# Altium project ISL6236A Board.PrjPcb
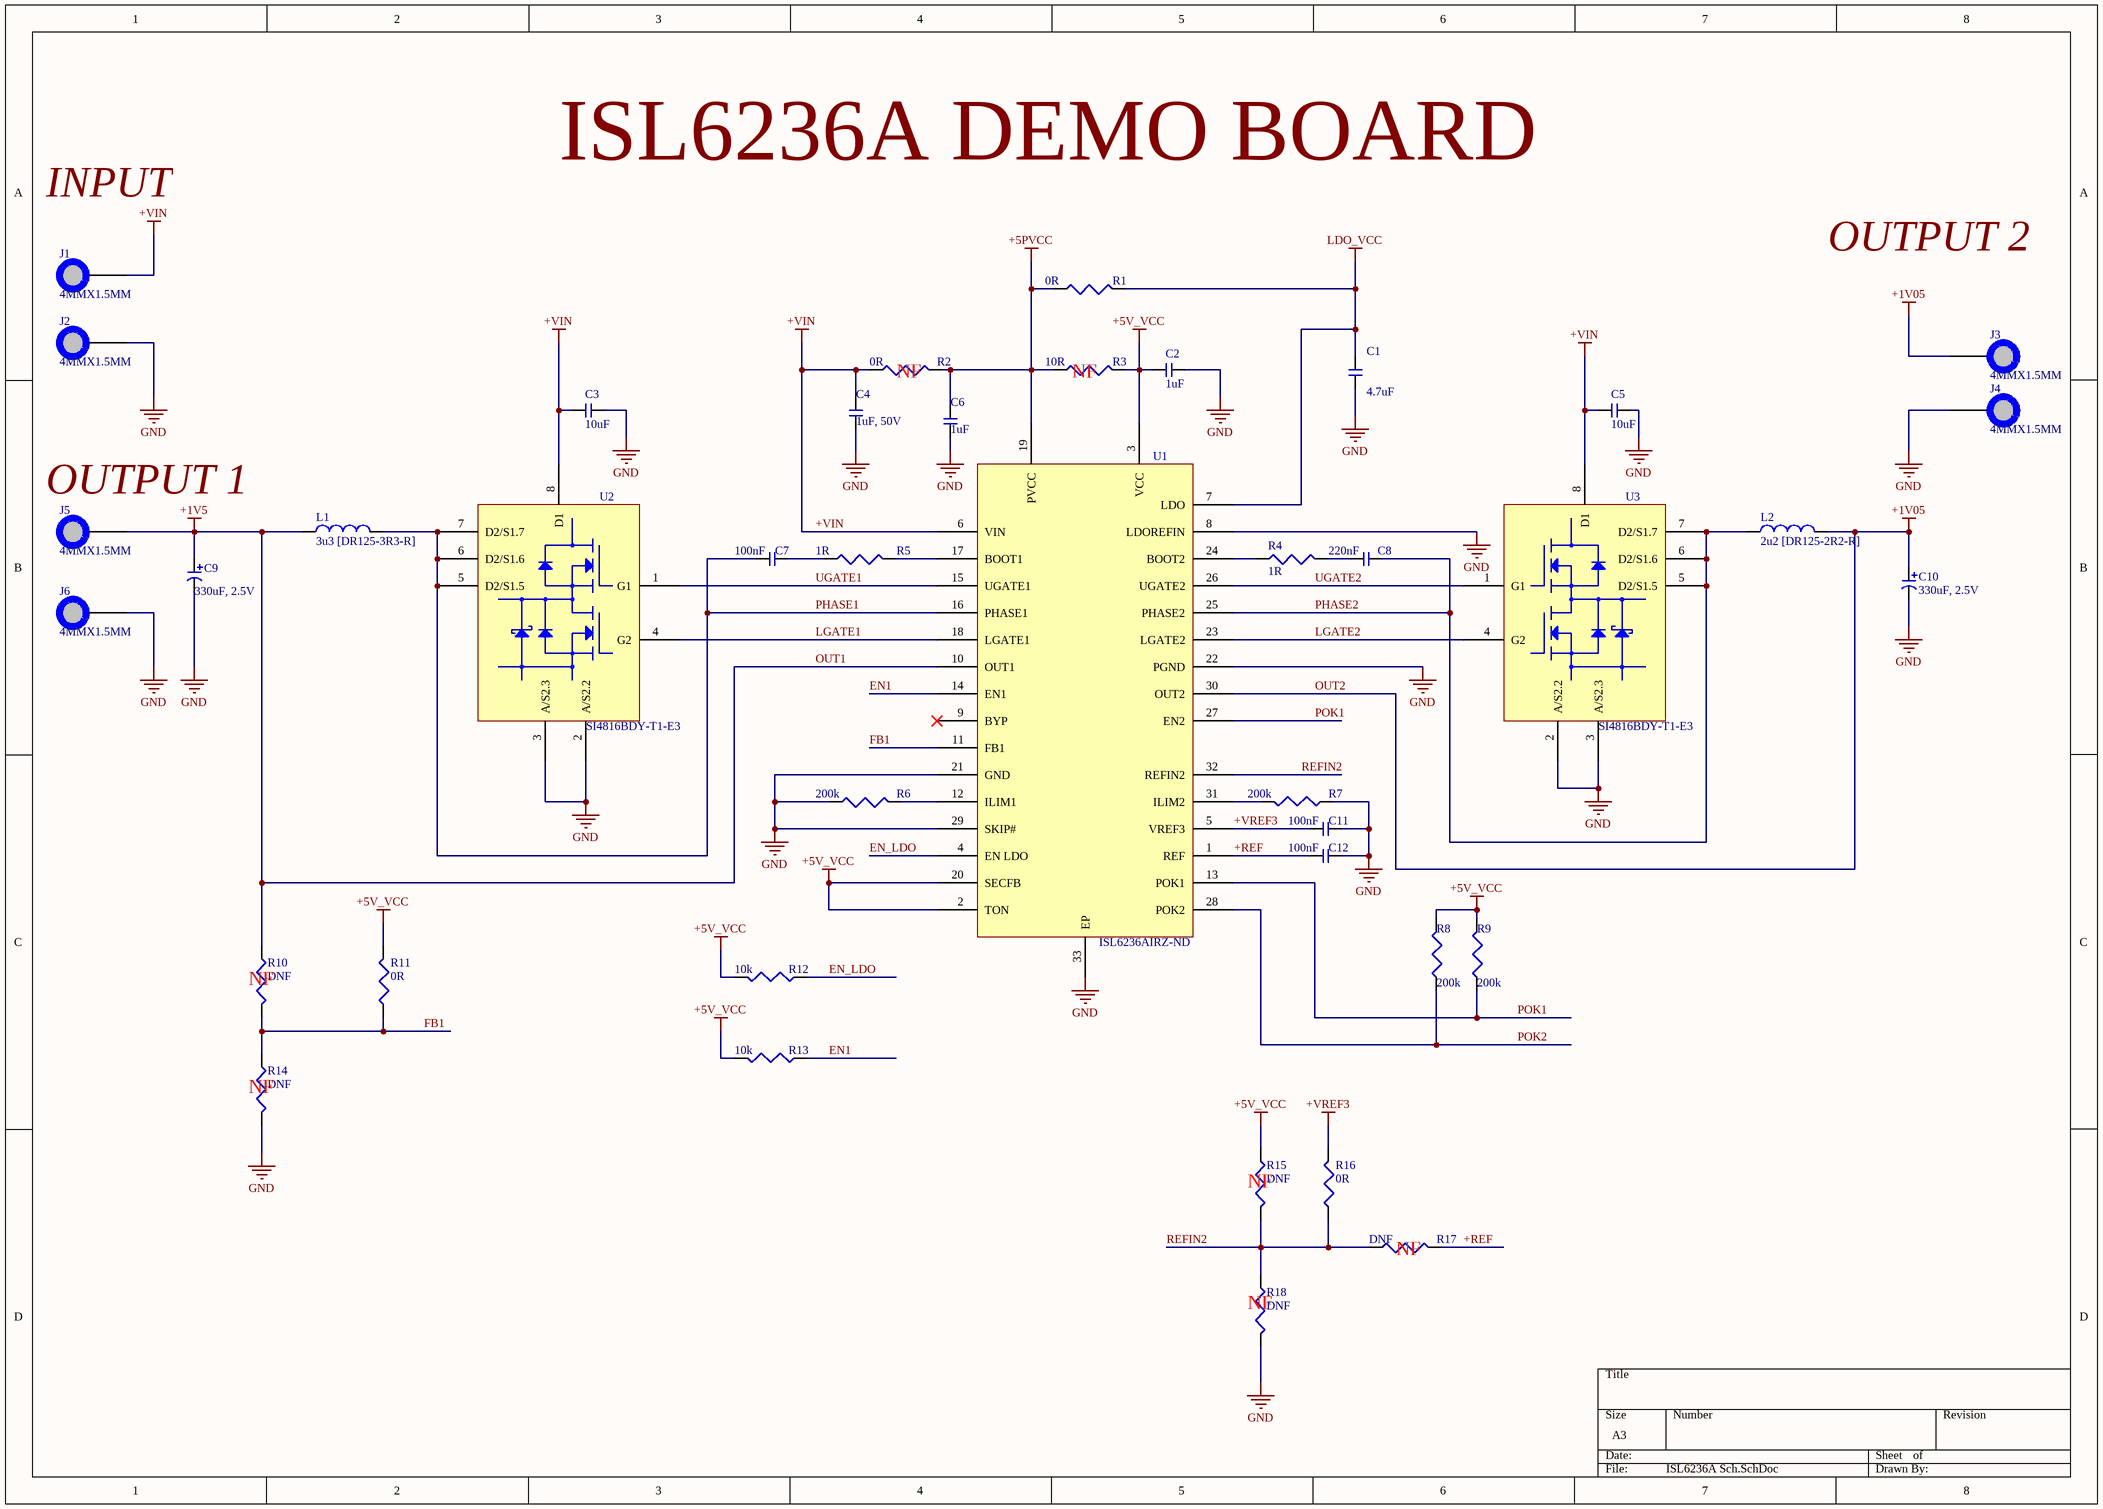
[diagram p0: ISL6236A Sch.SchDoc]
1 sheet, 41 parts. Net scope: global (net labels, ports and power ports of the same name join across sheets).
Board file: ISL6236A PCB.PcbDoc

## Sheet ISL6236A Sch.SchDoc
size A3

### Parts
C1  4.7uF  [C0805]
C2  1uF  [C0805]
C3  10uF  [C1210]
C4  1uF, 50V  [C0805]
C5  10uF  [C1210]
C6  1uF  [C0805]
C7  100nF  [C0805]
C8  220nF  [C1206]
C9  330uF, 2.5V  [CPOL1210TCJ]
C10  330uF, 2.5V  [CPOL1210TCJ]
C11  100nF  [C0805]
C12  100nF  [C0805]
J1  4MMX1.5MM  [PAD_WITH_HOLE_4MMX1.5MM]
J2  4MMX1.5MM  [PAD_WITH_HOLE_4MMX1.5MM]
J3  4MMX1.5MM  [PAD_WITH_HOLE_4MMX1.5MM]
J4  4MMX1.5MM  [PAD_WITH_HOLE_4MMX1.5MM]
J5  4MMX1.5MM  [PAD_WITH_HOLE_4MMX1.5MM]
J6  4MMX1.5MM  [PAD_WITH_HOLE_4MMX1.5MM]
L1  3u3 [DR125-3R3-R]  [DR125]
L2  2u2 [DR125-2R2-R]  [DR125]
R1  0R  [R0603]
R2  0R  [R0603]
R3  10R  [R0805]
R4  1R  [R0805]
R5  1R  [R0805]
R6  200k  [R0805]
R7  200k  [R0805]
R8  200k  [R0805]
R9  200k  [R0805]
R10  DNF  [R0805]
R11  0R  [R0603]
R12  10k  [R0805]
R13  10k  [R0805]
R14  DNF  [R0805]
R15  DNF  [R0805]
R16  0R  [R0603]
R17  DNF  [R0805]
R18  DNF  [R0805]
U1  ISL6236AIRZ-ND  [L32.5x5B]
U2  SI4816BDY-T1-E3  [SO-8]
U3  SI4816BDY-T1-E3  [SO-8]

### Nets
+5PVCC: C6.2 R1.1 R2.2 R3.1 U1.19(PVCC)
+5V_VCC: C2.1 R3.2 R8.2 R9.2 R11.2 R12.2 R13.2 R15.1 U1.2(TON) U1.3(VCC) U1.20(SECFB)
+VIN: C3.2 C4.1 C5.1 J1.1 R2.1 U1.6(VIN) U2.8(D1) U3.8(D1)
+VREF3: C11.1 R16.2 U1.5(VREF3)
GND: C1.2 C2.2 C3.1 C4.2 C5.2 C6.1 C9.2 C10.2 C11.2 C12.2 J2.1 J4.1 J6.1 R6.1 R7.1 R14.2 R18.2 U1.8(LDOREFIN) U1.21(GND) U1.22(PGND) U1.29(SKIP#) U1.33(EP) U2.2(A/S2.2) U2.3(A/S2.3) U3.2(A/S2.2) U3.3(A/S2.3)
LDO_VCC: C1.1 R1.2 U1.7(LDO)
OUT1: C9.1 J5.1 L1.1 R10.1 U1.10(OUT1)  [also labelled +1V5]
OUT2: C10.1 J3.1 L2.2 U1.30(OUT2)  [also labelled +1V05]
+REF: C12.1 R17.2 U1.1(REF)
EN1: R13.1 U1.14(EN1)
EN_LDO: R12.1 U1.4(EN_LDO)
FB1: R10.2 R11.1 R14.1 U1.11(FB1)
LGATE1: U1.18(LGATE1) U2.4(G2)
LGATE2: U1.23(LGATE2) U3.4(G2)
PHASE1: C7.2 L1.2 U1.16(PHASE1) U2.5(D2/S1.5) U2.6(D2/S1.6) U2.7(D2/S1.7)
PHASE2: C8.2 L2.1 U1.25(PHASE2) U3.5(D2/S1.5) U3.6(D2/S1.6) U3.7(D2/S1.7)
POK1: R9.1 U1.13(POK1) U1.27(EN2)
POK2: R8.1 U1.28(POK2)
REFIN2: R15.2 R16.1 R17.1 R18.1 U1.32(REFIN2)
UGATE1: U1.15(UGATE1) U2.1(G1)
UGATE2: U1.26(UGATE2) U3.1(G1)
NetC7_1: C7.1 R5.1
NetC8_1: C8.1 R4.2
NetR4_1: R4.1 U1.24(BOOT2)
NetR5_2: R5.2 U1.17(BOOT1)
NetR6_2: R6.2 U1.12(ILIM1)
NetR7_2: R7.2 U1.31(ILIM2)

Not connected (* = marked no-connect by the designer): U1 9(BYP)*

### Notes on the sheet
- ISL6236A DEMO BOARD
- INPUT
- OUTPUT 2
- (near R2) NF
- (near R3) NF
- (near J5) OUTPUT 1
- (near R10) NF
- (near R14) NF
- (near R15) NF
- (near R17) NF
- (near R18) NF

### Library data of the parts
C1 = CC0805ZRY5V6BB475: CAP CER 4.7UF 10V Y5V 0805; Manufacturer: Yageo; Capacitance: 4.7µF; Tolerance: -20%, +80%; Temperature Coefficient: Y5V (F); Supplier 1: Digi-Key; Manufacturer Part Number: CC0805ZRY5V6BB475; RoHS: RoHS Compliant; Category: Capacitors; Stock 1: 93461; Pricing 1: 1=0.1, 10=0.076, 25=0.0536, 100=0.0348, 250=0.02844, 500=0.02434, 1000=0.01896 (USD); Packaging: Cut Tape (CT); Voltage - Rated: 10V; Mounting Type: Surface Mount, MLCC; Operating Temperature: -30°C ~ 85°C; Applications: General Purpose; Ratings: -; Package / Case: 0805 (2012 Metric); Size / Dimension: 0.079" L x 0.049" W (2.00mm x 1.25mm); Height - Seated (Max): -; Thickness (Max): 0.033" (0.85mm); Lead Spacing: -; Features: -; Lead Style: -; ComponentLink1URL: http://www.yageo.com/documents/recent/UPY-GPHC_Y5V_6.3V-to-50V_6.pdf; ComponentLink1Description: http://www.yageo.com/documents/recent/UPY-GPHC_Y5V_6.3V-to-50V_6.pdf; Supplier Part Number 1: 311-1371-1-ND
C2 C6 = 08053D105KAT2A: CAP CER 1UF 25V X5R 0805; Manufacturer: AVX Corporation; Capacitance: 1µF; Tolerance: ±10%; Supplier 1: Digi-Key; Manufacturer Part Number: 08053D105KAT2A; RoHS: RoHS Compliant; Category: Capacitors; Stock 1: 85698; Pricing 1: 1=0.48, 10=0.42, 100=0.21, 250=0.168, 500=0.153, 1000=0.138 (USD); Packaging: Cut Tape (CT); Voltage - Rated: 25V; Temperature Coefficient: X5R; Mounting Type: Surface Mount, MLCC; Operating Temperature: -55°C ~ 85°C; Applications: General Purpose; Ratings: -; Package / Case: 0805 (2012 Metric); Size / Dimension: 0.079" L x 0.049" W (2.01mm x 1.25mm); Height - Seated (Max): -; Thickness (Max): 0.055" (1.40mm); Lead Spacing: -; Features: -; Lead Style: -; ComponentLink1URL: http://datasheets.avx.com/cx5r.pdf; ComponentLink1Description: http://datasheets.avx.com/cx5r.pdf; Supplier Part Number 1: 478-1409-1-ND
C3 C5 = 885012109013: CAP CER 10UF 25V X5R 1210; Manufacturer: Wurth Electronics Inc; Capacitance: 10µF; Tolerance: ±20%; Supplier 1: Digi-Key; Manufacturer Part Number: 885012109013; RoHS: RoHS Compliant; Category: Capacitors; Stock 1: 940; Pricing 1: 1=0.37, 50=0.3124, 100=0.2722, 250=0.24192, 500=0.21168 (USD); Packaging: Cut Tape (CT); Voltage - Rated: 25V; Temperature Coefficient: X5R; Mounting Type: Surface Mount, MLCC; Operating Temperature: -55°C ~ 85°C; Applications: General Purpose; Ratings: -; Package / Case: 1210 (3225 Metric); Size / Dimension: 0.126" L x 0.098" W (3.20mm x 2.50mm); Height - Seated (Max): -; Thickness (Max): 0.087" (2.20mm); Lead Spacing: -; Features: -; Lead Style: -; ComponentLink1URL: http://katalog.we-online.de/pbs/datasheet/885012109013.pdf; ComponentLink1Description: http://katalog.we-online.de/pbs/datasheet/885012109013.pdf; Supplier Part Number 1: 732-7384-1-ND
C4 = GRM2195C1H103FA01D: CAP CER 10000PF 50V NP0 0805; Manufacturer: Murata Electronics North America; Tolerance: ±1%; Temperature Coefficient: C0G, NP0; Supplier 1: Digi-Key; Manufacturer Part Number: GRM2195C1H103FA01D; RoHS: RoHS Compliant; Category: Capacitors; Stock 1: 52284; Pricing 1: 1=0.44, 10=0.385, 50=0.2338, 100=0.1925, 250=0.154, 500=0.14026, 1000=0.1265 (USD); Packaging: Cut Tape (CT); Capacitance: 10000pF; Voltage - Rated: 50V; Mounting Type: Surface Mount, MLCC; Operating Temperature: -55°C ~ 125°C; Applications: General Purpose; Ratings: -; Package / Case: 0805 (2012 Metric); Size / Dimension: 0.079" L x 0.049" W (2.00mm x 1.25mm); Height - Seated (Max): -; Thickness (Max): 0.037" (0.95mm); Lead Spacing: -; Features: -; Lead Style: -; ComponentLink1URL: http://www.murata.com/~/media/webrenewal/support/library/catalog/products/capacitor/mlcc/c02e.pdf; ComponentLink1Description: http://www.murata.com/~/media/webrenewal/support/library/catalog/products/capacitor/mlcc/c02e.pdf; Supplier Part Number 1: 490-8295-1-ND
C7 C11 C12 = 08055C104KAT2A: CAP CER 0.1UF 50V X7R 0805; Manufacturer: AVX Corporation; Capacitance: 0.10µF; Tolerance: ±10%; Supplier 1: Digi-Key; Manufacturer Part Number: 08055C104KAT2A; RoHS: RoHS Compliant; Category: Capacitors; Stock 1: 6637140; Pricing 1: 1=0.1, 10=0.036, 100=0.0165, 250=0.01352, 500=0.01156, 1000=0.009 (USD); Packaging: Cut Tape (CT); Voltage - Rated: 50V; Temperature Coefficient: X7R; Mounting Type: Surface Mount, MLCC; Operating Temperature: -55°C ~ 125°C; Applications: General Purpose; Ratings: -; Package / Case: 0805 (2012 Metric); Size / Dimension: 0.079" L x 0.049" W (2.01mm x 1.25mm); Height - Seated (Max): -; Thickness (Max): 0.037" (0.94mm); Lead Spacing: -; Features: -; Lead Style: -; ComponentLink1URL: http://datasheets.avx.com/X7RDielectric.pdf; ComponentLink1Description: http://datasheets.avx.com/X7RDielectric.pdf; Supplier Part Number 1: 478-1395-1-ND
C8 = CL31F224ZBCNNNC: CAP CER 0.22UF 50V Y5V 1206; Manufacturer: Samsung Electro-Mechanics America, Inc.; Capacitance: 0.22µF; Tolerance: -20%, +80%; Temperature Coefficient: Y5V (F); Supplier 1: Digi-Key; Manufacturer Part Number: CL31F224ZBCNNNC; RoHS: RoHS Compliant; Category: Capacitors; Stock 1: 8569; Pricing 1: 1=0.1, 10=0.056, 25=0.0396, 50=0.0302, 100=0.0255, 500=0.01786, 1000=0.01392 (USD); Packaging: Cut Tape (CT); Voltage - Rated: 50V; Mounting Type: Surface Mount, MLCC; Operating Temperature: -30°C ~ 85°C; Applications: General Purpose; Ratings: -; Package / Case: 1206 (3216 Metric); Size / Dimension: 0.126" L x 0.063" W (3.20mm x 1.60mm); Height - Seated (Max): -; Thickness (Max): 0.039" (1.00mm); Lead Spacing: -; Features: -; Lead Style: -; ComponentLink1URL: http://media.digikey.com/pdf/Data%20Sheets/Samsung%20PDFs/CL31F224ZBCNNNC_Spec.pdf; ComponentLink1Description: http://media.digikey.com/pdf/Data%20Sheets/Samsung%20PDFs/CL31F224ZBCNNNC_Spec.pdf; Supplier Part Number 1: 1276-2859-1-ND
C9 C10 = TCJB337M002R0070: CAP TANT POLY 330UF 2.5V 1210; Manufacturer: AVX Corporation; Manufacturer Size Code: B; Capacitance: 330µF; Tolerance: ±20%; ESR (Equivalent Series Resistance): 70 mOhm; Type: Molded; Lifetime @ Temp.: 2000 Hrs @ 105°C; Supplier 1: Digi-Key; Manufacturer Part Number: TCJB337M002R0070; RoHS: RoHS Compliant; Category: Capacitors; Stock 1: 1894; Pricing 1: 1=1.29, 10=1.081, 100=0.69, 250=0.575, 500=0.5175, 1000=0.4715 (USD); Packaging: Cut Tape (CT); Voltage - Rated: 2.5V; Operating Temperature: -55°C ~ 105°C; Mounting Type: Surface Mount; Package / Case: 1210 (3528 Metric); Size / Dimension: 0.138" L x 0.110" W (3.50mm x 2.80mm); Height - Seated (Max): 0.083" (2.10mm); Lead Spacing: -; Features: Derating Recommended, General Purpose; ComponentLink1URL: http://datasheets.avx.com/TCJ.pdf; ComponentLink1Description: http://datasheets.avx.com/TCJ.pdf; Supplier Part Number 1: 478-9421-1-ND
J1-J6 = PAD_WITH_HOLE_4MMX1.5MM
L1 = DR125-3R3-R: FIXED IND 3.3UH 9.26A 6.3 MOHM; Manufacturer: Eaton; Type: Wirewound; Material - Core: Ferrite; Inductance: 3.3µH; Tolerance: ±20%; Current - Saturation: 12.7A; Shielding: Shielded; Frequency - Test: 100kHz; Supplier 1: Digi-Key; Manufacturer Part Number: DR125-3R3-R; RoHS: RoHS Compliant; Category: Inductors, Coils, Chokes; Stock 1: 6411; Pricing 1: 1=1.82, 10=1.683, 25=1.5428, 50=1.3184, 100=1.1781, 250=1.0098 (USD); Packaging: Cut Tape (CT); Current Rating: 9.26A; DC Resistance (DCR): 6.3 mOhm; Q @ Freq: -; Frequency - Self Resonant: -; Ratings: -; Operating Temperature: -40°C ~ 125°C; Mounting Type: Surface Mount; Package / Case: Nonstandard; Size / Dimension: 0.492" L x 0.492" W (12.50mm x 12.50mm); Height - Seated (Max): 0.236" (6.00mm); ComponentLink1URL: http://www.cooperindustries.com/content/dam/public/bussmann/Electronics/Resources/product-datasheets/Bus_Elx_DS_4315_DR_Series.pdf; ComponentLink1Description: http://www.cooperindustries.com/content/dam/public/bussmann/Electronics/Resources/product-datasheets/Bus_Elx_DS_4315_DR_Series.pdf; Supplier Part Number 1: 513-1529-1-ND
L2 = DR125-2R2-R: FIXED IND 2.2UH 10.9A 4.5 MOHM; Manufacturer: Eaton; Type: Wirewound; Material - Core: Ferrite; Inductance: 2.2µH; Tolerance: ±20%; Current - Saturation: 15A; Shielding: Shielded; Frequency - Test: 100kHz; Supplier 1: Digi-Key; Manufacturer Part Number: DR125-2R2-R; RoHS: RoHS Compliant; Category: Inductors, Coils, Chokes; Stock 1: 458; Pricing 1: 1=1.82, 10=1.683, 25=1.5428, 50=1.3184, 100=1.1781, 250=1.0098 (USD); Packaging: Cut Tape (CT); Current Rating: 10.9A; DC Resistance (DCR): 4.5 mOhm; Q @ Freq: -; Frequency - Self Resonant: -; Ratings: -; Operating Temperature: -40°C ~ 125°C; Mounting Type: Surface Mount; Package / Case: Nonstandard; Size / Dimension: 0.492" L x 0.492" W (12.50mm x 12.50mm); Height - Seated (Max): 0.236" (6.00mm); ComponentLink1URL: http://www.cooperindustries.com/content/dam/public/bussmann/Electronics/Resources/product-datasheets/Bus_Elx_DS_4315_DR_Series.pdf; ComponentLink1Description: http://www.cooperindustries.com/content/dam/public/bussmann/Electronics/Resources/product-datasheets/Bus_Elx_DS_4315_DR_Series.pdf; Supplier Part Number 1: 513-1662-1-ND
R1 R2 R11 R16 = RC0603JR-070RL: RES SMD 0.0OHM JUMPER 1/10W 0603; Manufacturer: Yageo; Resistance (Ohms): 0.0; Power (Watts): 0.1W, 1/10W; Supplier 1: Digi-Key; Manufacturer Part Number: RC0603JR-070RL; RoHS: RoHS Compliant; Category: Resistors; Stock 1: 6593569; Pricing 1: 1=0.1, 10=0.011, 25=0.008, 100=0.0045, 250=0.00348, 500=0.00278, 1000=0.00204, 2500=0.00177 (USD); Packaging: Cut Tape (CT); Tolerance: Jumper; Composition: Thick Film; Features: Moisture Resistant; Temperature Coefficient: -; Operating Temperature: -55°C ~ 155°C; Package / Case: 0603 (1608 Metric); Supplier Device Package: 0603; Size / Dimension: 0.063" L x 0.031" W (1.60mm x 0.80mm); Height: 0.022" (0.55mm); Number of Terminations: 2; ComponentLink1URL: http://www.yageo.com/documents/recent/PYu-RC_Group_51_RoHS_L_04.pdf; ComponentLink1Description: http://www.yageo.com/documents/recent/PYu-RC_Group_51_RoHS_L_04.pdf; Supplier Part Number 1: 311-0.0GRCT-ND
R3 = ESR10EZPJ100: RES SMD 10 OHM 5% 0.4W 0805; Manufacturer: Rohm Semiconductor; Resistance (Ohms): 10; Temperature Coefficient: ±200ppm/°C; Supplier 1: Digi-Key; Manufacturer Part Number: ESR10EZPJ100; RoHS: RoHS Compliant; Category: Resistors; Stock 1: 48150; Pricing 1: 1=0.1, 10=0.079, 25=0.0544, 100=0.0303, 250=0.0236, 500=0.01876, 1000=0.01331 (USD); Packaging: Cut Tape (CT); Tolerance: ±5%; Power (Watts): 0.4W; Composition: Thick Film; Features: Automotive AEC-Q200, Pulse Withstanding; Operating Temperature: -55°C ~ 155°C; Package / Case: 0805 (2012 Metric); Supplier Device Package: 0805 (2012 Metric); Size / Dimension: 0.079" L x 0.049" W (2.00mm x 1.25mm); Height: 0.026" (0.65mm); Number of Terminations: 2; ComponentLink1URL: http://rohmfs.rohm.com/en/products/databook/datasheet/passive/resistor/chip_resistor/esr.pdf; ComponentLink1Description: http://rohmfs.rohm.com/en/products/databook/datasheet/passive/resistor/chip_resistor/esr.pdf; Supplier Part Number 1: RHM10KCT-ND
R4 R5 = RMCF0805FT1R00: RES SMD 1 OHM 1% 1/8W 0805; Manufacturer: Stackpole Electronics Inc.; Resistance (Ohms): 1; Power (Watts): 0.125W, 1/8W; Temperature Coefficient: ±200ppm/°C; Supplier 1: Digi-Key; Manufacturer Part Number: RMCF0805FT1R00; RoHS: RoHS Compliant; Category: Resistors; Stock 1: 56878; Pricing 1: 1=0.1, 10=0.022, 50=0.0124, 100=0.0091, 250=0.00692, 500=0.00554, 1000=0.00408, 2500=0.00354 (USD); Packaging: Cut Tape (CT); Tolerance: ±1%; Composition: Thick Film; Features: Automotive AEC-Q200; Operating Temperature: -55°C ~ 155°C; Package / Case: 0805 (2012 Metric); Supplier Device Package: 0805; Size / Dimension: 0.079" L x 0.049" W (2.00mm x 1.25mm); Height: 0.026" (0.65mm); Number of Terminations: 2; ComponentLink1URL: http://www.seielect.com/Catalog/SEI-RMCF_RMCP.pdf; ComponentLink1Description: http://www.seielect.com/Catalog/SEI-RMCF_RMCP.pdf; Supplier Part Number 1: RMCF0805FT1R00CT-ND
R6-R9 = RC0805FR-07200KL: RES SMD 200K OHM 1% 1/8W 0805; Manufacturer: Yageo; Power (Watts): 0.125W, 1/8W; Temperature Coefficient: ±100ppm/°C; Supplier 1: Digi-Key; Manufacturer Part Number: RC0805FR-07200KL; RoHS: RoHS Compliant; Category: Resistors; Stock 1: 636212; Pricing 1: 1=0.1, 10=0.021, 25=0.0152, 100=0.0084, 250=0.00644, 500=0.00514, 1000=0.00379, 2500=0.00329 (USD); Packaging: Cut Tape (CT); Resistance (Ohms): 200k; Tolerance: ±1%; Composition: Thick Film; Features: Moisture Resistant; Operating Temperature: -55°C ~ 155°C; Package / Case: 0805 (2012 Metric); Supplier Device Package: 0805; Size / Dimension: 0.079" L x 0.049" W (2.00mm x 1.25mm); Height: 0.024" (0.60mm); Number of Terminations: 2; ComponentLink1URL: http://www.yageo.com/documents/recent/PYu-RC_Group_51_RoHS_L_04.pdf; ComponentLink1Description: http://www.yageo.com/documents/recent/PYu-RC_Group_51_RoHS_L_04.pdf; Supplier Part Number 1: 311-200KCRCT-ND
R10 R14 R15 R17 R18 = RES
R12 R13 = RR1220P-103-D: RES SMD 10K OHM 0.5% 1/10W 0805; Manufacturer: Susumu; Power (Watts): 0.1W, 1/10W; Temperature Coefficient: ±25ppm/°C; Supplier 1: Digi-Key; Manufacturer Part Number: RR1220P-103-D; RoHS: RoHS Compliant; Category: Resistors; Stock 1: 413461; Pricing 1: 1=0.1, 10=0.093, 25=0.0644, 50=0.0502, 100=0.0358, 250=0.02792, 500=0.0222, 1000=0.01575 (USD); Packaging: Cut Tape (CT); Resistance (Ohms): 10k; Tolerance: ±0.5%; Composition: Thin Film; Features: -; Operating Temperature: -55°C ~ 125°C; Package / Case: 0805 (2012 Metric); Supplier Device Package: -; Size / Dimension: 0.079" L x 0.049" W (2.00mm x 1.25mm); Height: 0.020" (0.50mm); Number of Terminations: 2; ComponentLink1URL: http://www.susumu-usa.com/pdf/RR_Data_Sheet.pdf; ComponentLink1Description: http://www.susumu-usa.com/pdf/RR_Data_Sheet.pdf; Supplier Part Number 1: RR12P10.0KDCT-ND
U1 = ISL6236AIRZ: IC MAIN PWR CTRLR QUAD 32-QFN; Manufacturer: Intersil; Voltage - Input: 4.5 V ~ 25 V; Number of Outputs: 4; Voltage - Output: Multiple; Supplier 1: Digi-Key; Manufacturer Part Number: ISL6236AIRZ; RoHS: RoHS Compliant; Category: Integrated Circuits (ICs); Stock 1: 0; Pricing 1: 600=3.818 (USD); Packaging: Tube; Applications: Controller, Notebook Power System; Operating Temperature: -40°C ~ 100°C; Mounting Type: Surface Mount; Package / Case: 32-VFQFN Exposed Pad; Supplier Device Package: 32-QFN (5x5); ComponentLink1URL: http://www.intersil.com/content/dam/Intersil/documents/isl6/isl6236a.pdf; ComponentLink1Description: http://www.intersil.com/content/dam/Intersil/documents/isl6/isl6236a.pdf; Supplier Part Number 1: ISL6236AIRZ-ND
U2 U3 = SI4816BDY-T1-E3: MOSFET 2N-CH 30V 5.8A 8-SOIC; Manufacturer: Vishay Siliconix; FET Type: 2 N-Channel (Half Bridge); FET Feature: Logic Level Gate; Current - Continuous Drain (Id) @ 25°C: 5.8A, 8.2A; Rds On (Max) @ Id, Vgs: 18.5 mOhm @ 6.8A, 10V; Vgs(th) (Max) @ Id: 3V @ 250µA; Gate Charge (Qg) @ Vgs: 10nC @ 5V; Power - Max: 1W, 1.25W; Supplier 1: Digi-Key; Manufacturer Part Number: SI4816BDY-T1-E3; RoHS: RoHS Compliant; Category: Discrete Semiconductor Products; Stock 1: 4850; Pricing 1: 1=1.6, 10=1.439, 100=1.1541, 500=0.9486, 1000=0.78523 (USD); Packaging: Cut Tape (CT); Drain to Source Voltage (Vdss): 30V; Input Capacitance (Ciss) @ Vds: -; Operating Temperature: -55°C ~ 150°C (TJ); Mounting Type: Surface Mount; Package / Case: 8-SOIC (0.154", 3.90mm Width); Supplier Device Package: 8-SO; ComponentLink1URL: http://www.vishay.com/docs/73026/si4816bd.pdf; ComponentLink1Description: http://www.vishay.com/docs/73026/si4816bd.pdf; Supplier Part Number 1: SI4816BDY-T1-E3CT-ND